# EAGLE schematic soundpuddle_megawing_mk2 (EAGLE 6.3)
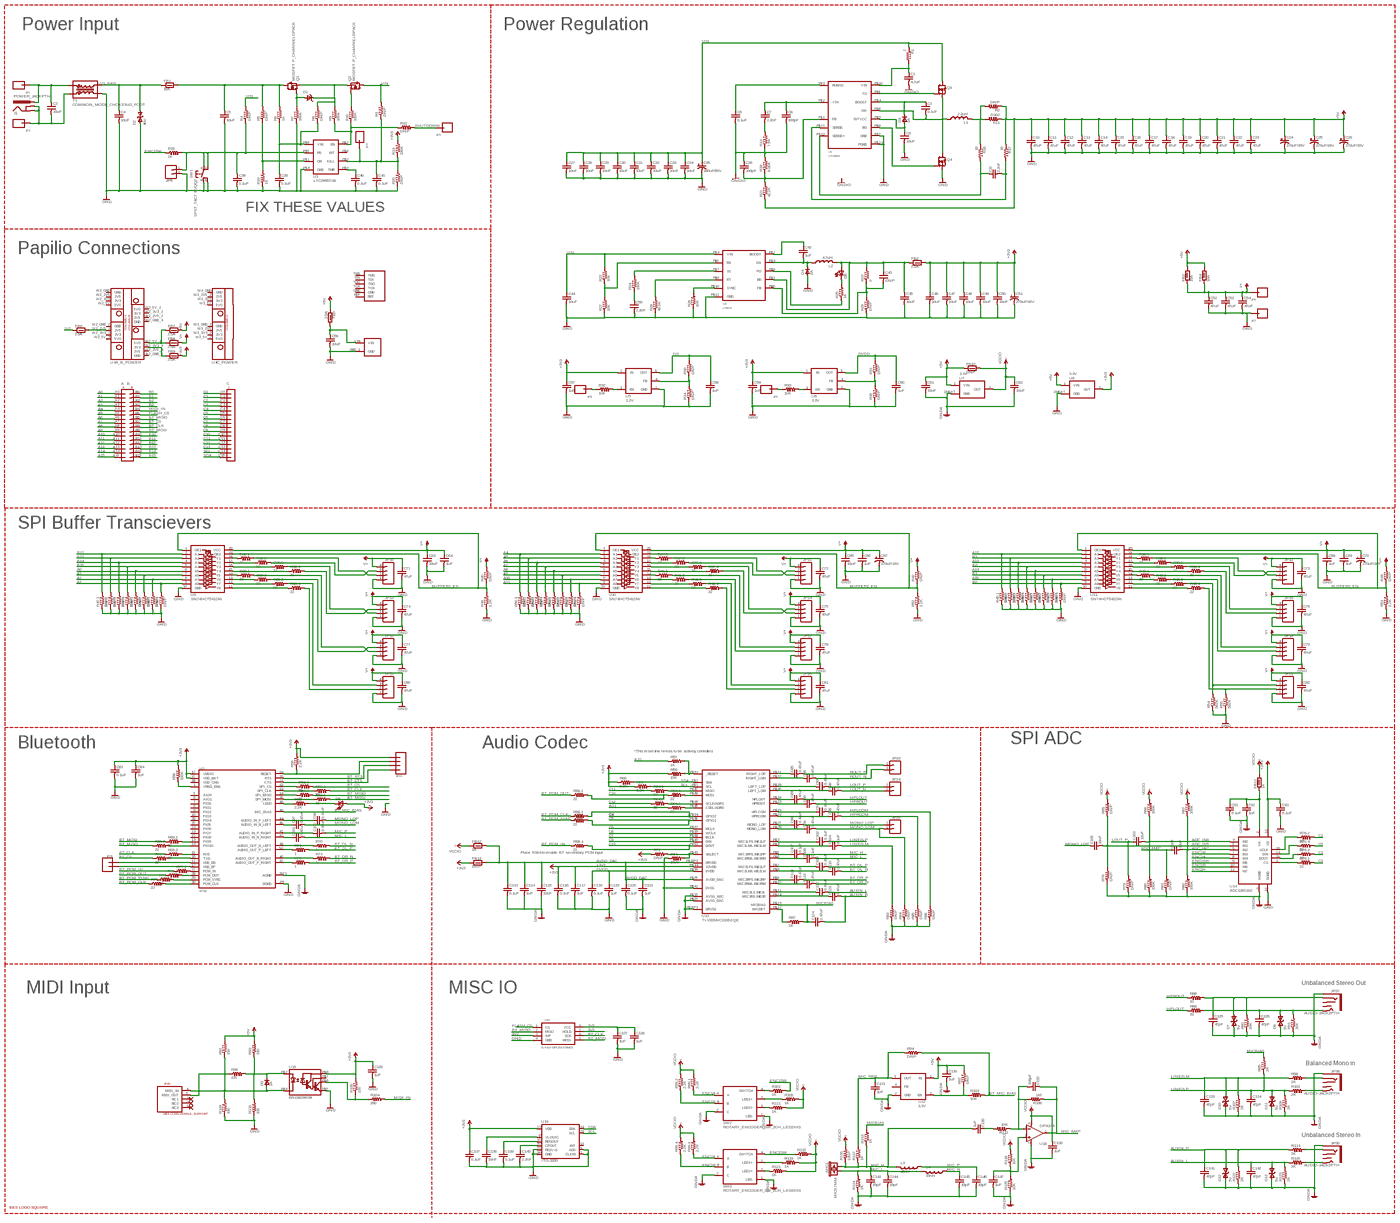
[diagram p0: schematic, sheet 1, overview]
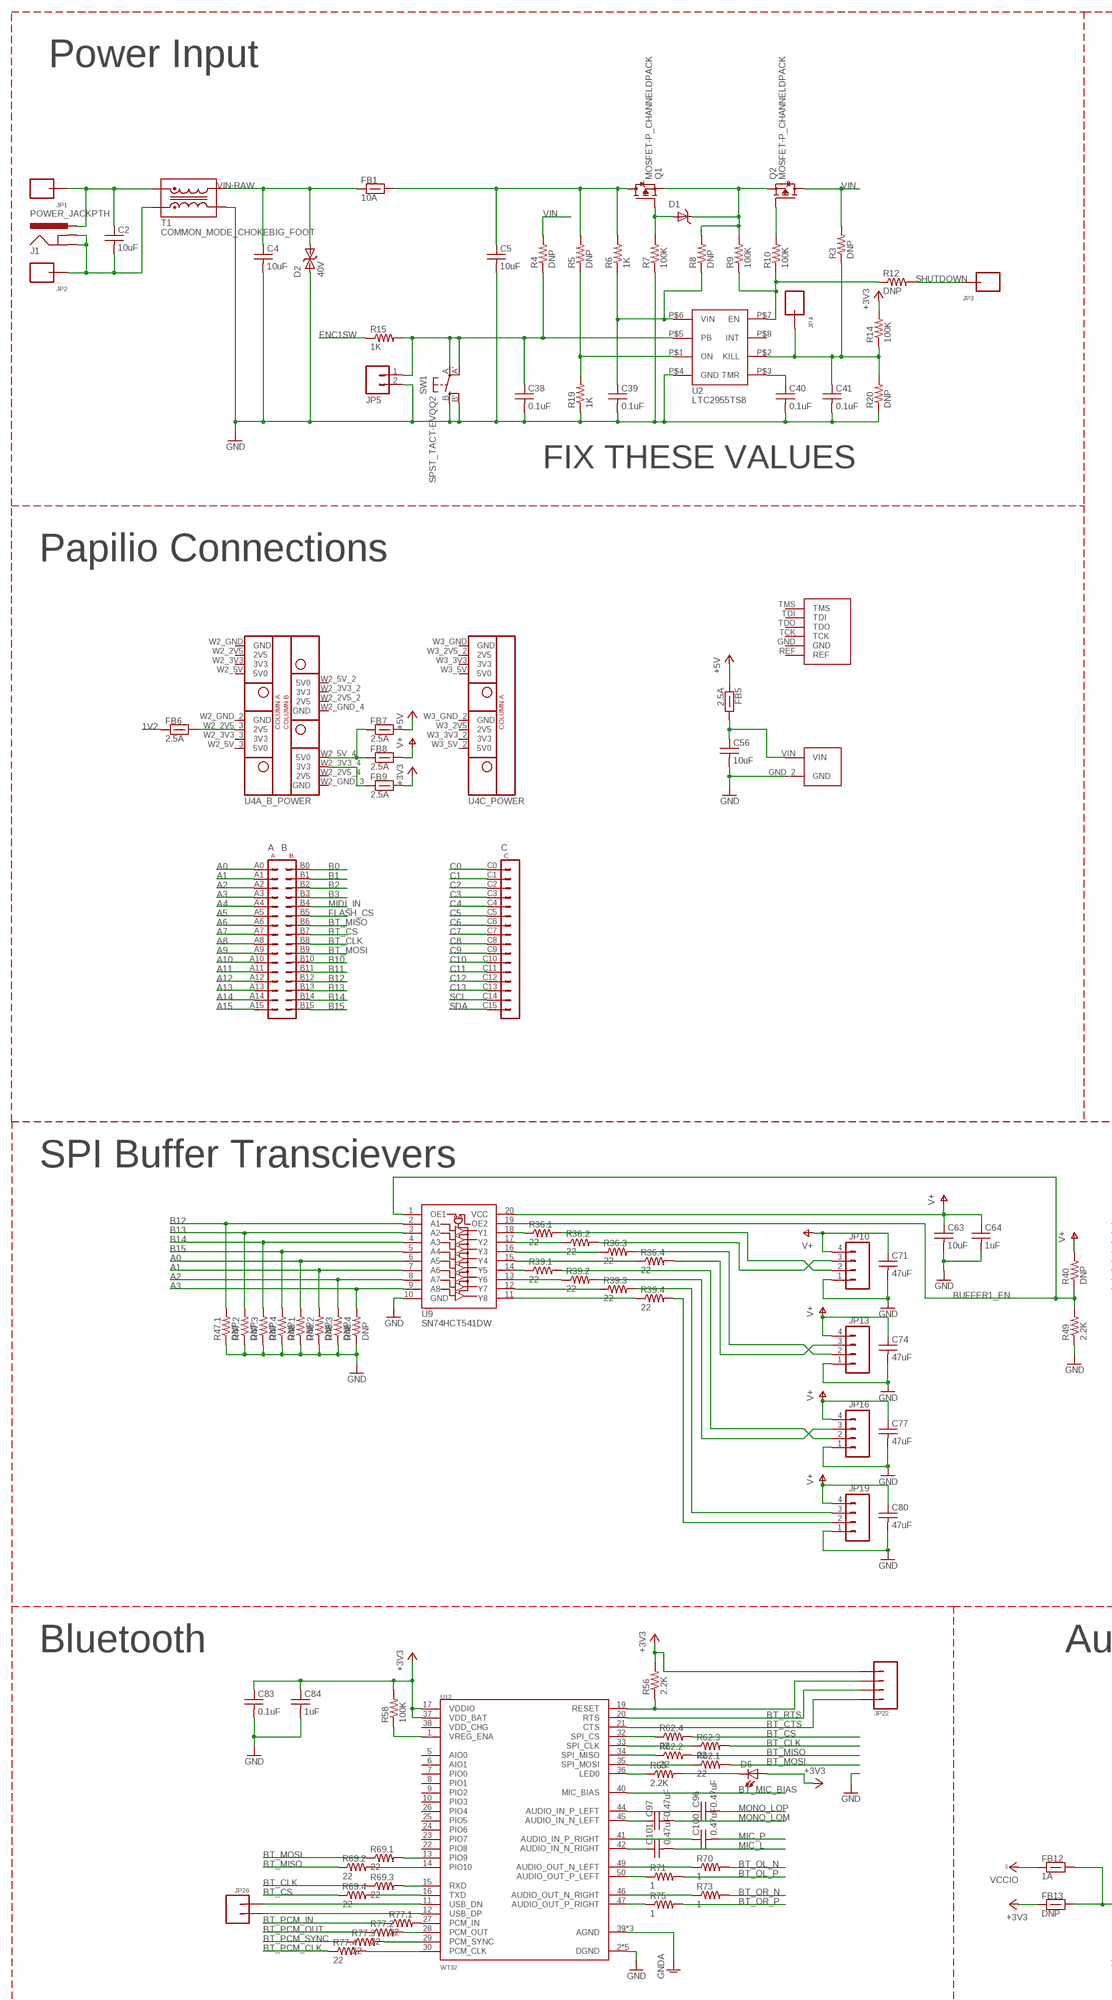
[diagram p1: schematic, sheet 1, part 1 of 4]
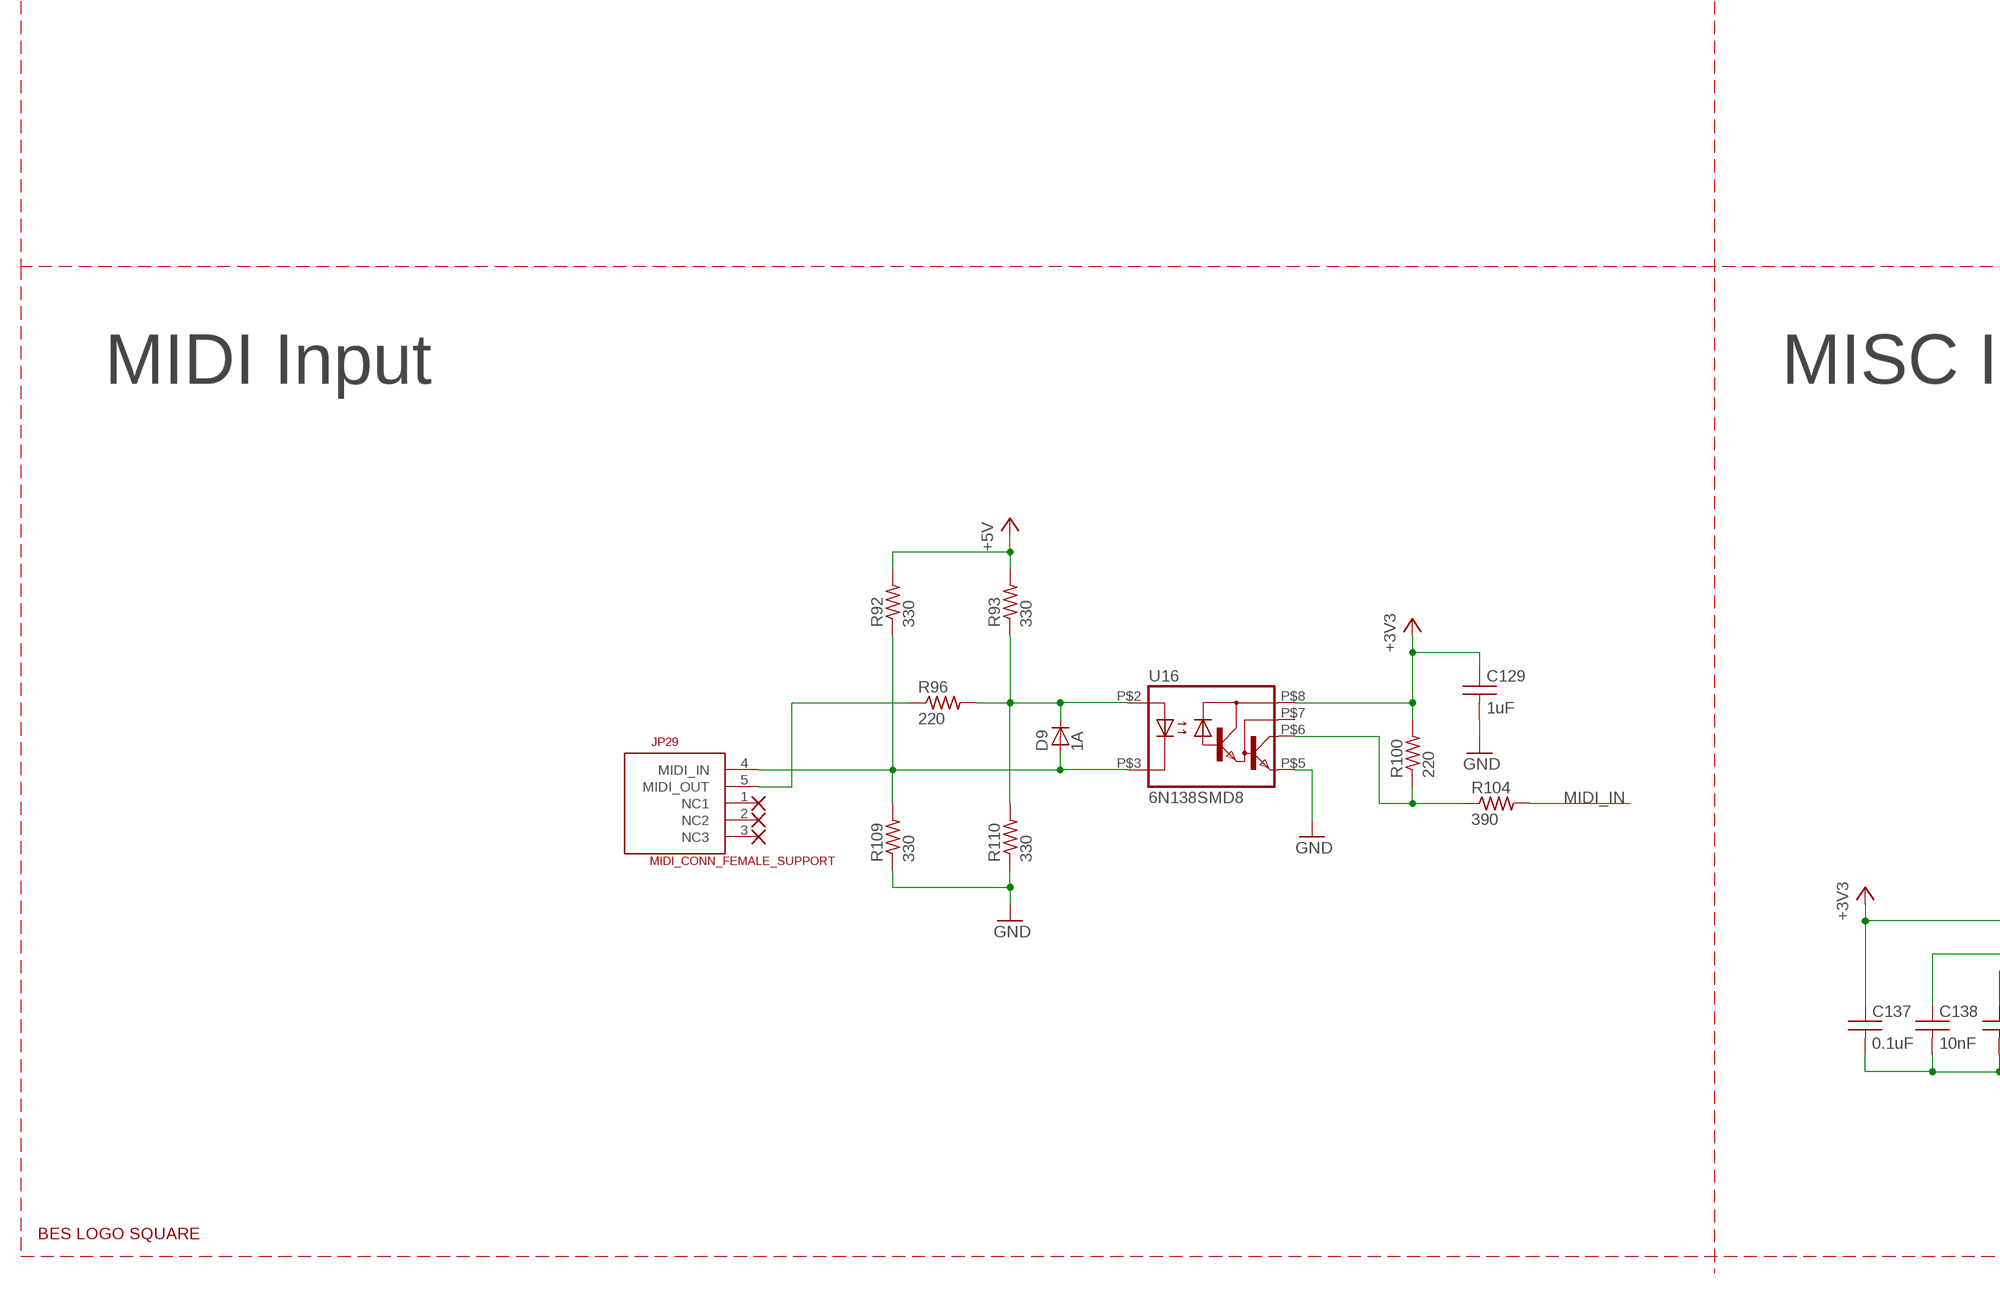
[diagram p2: schematic, sheet 1, part 2 of 4]
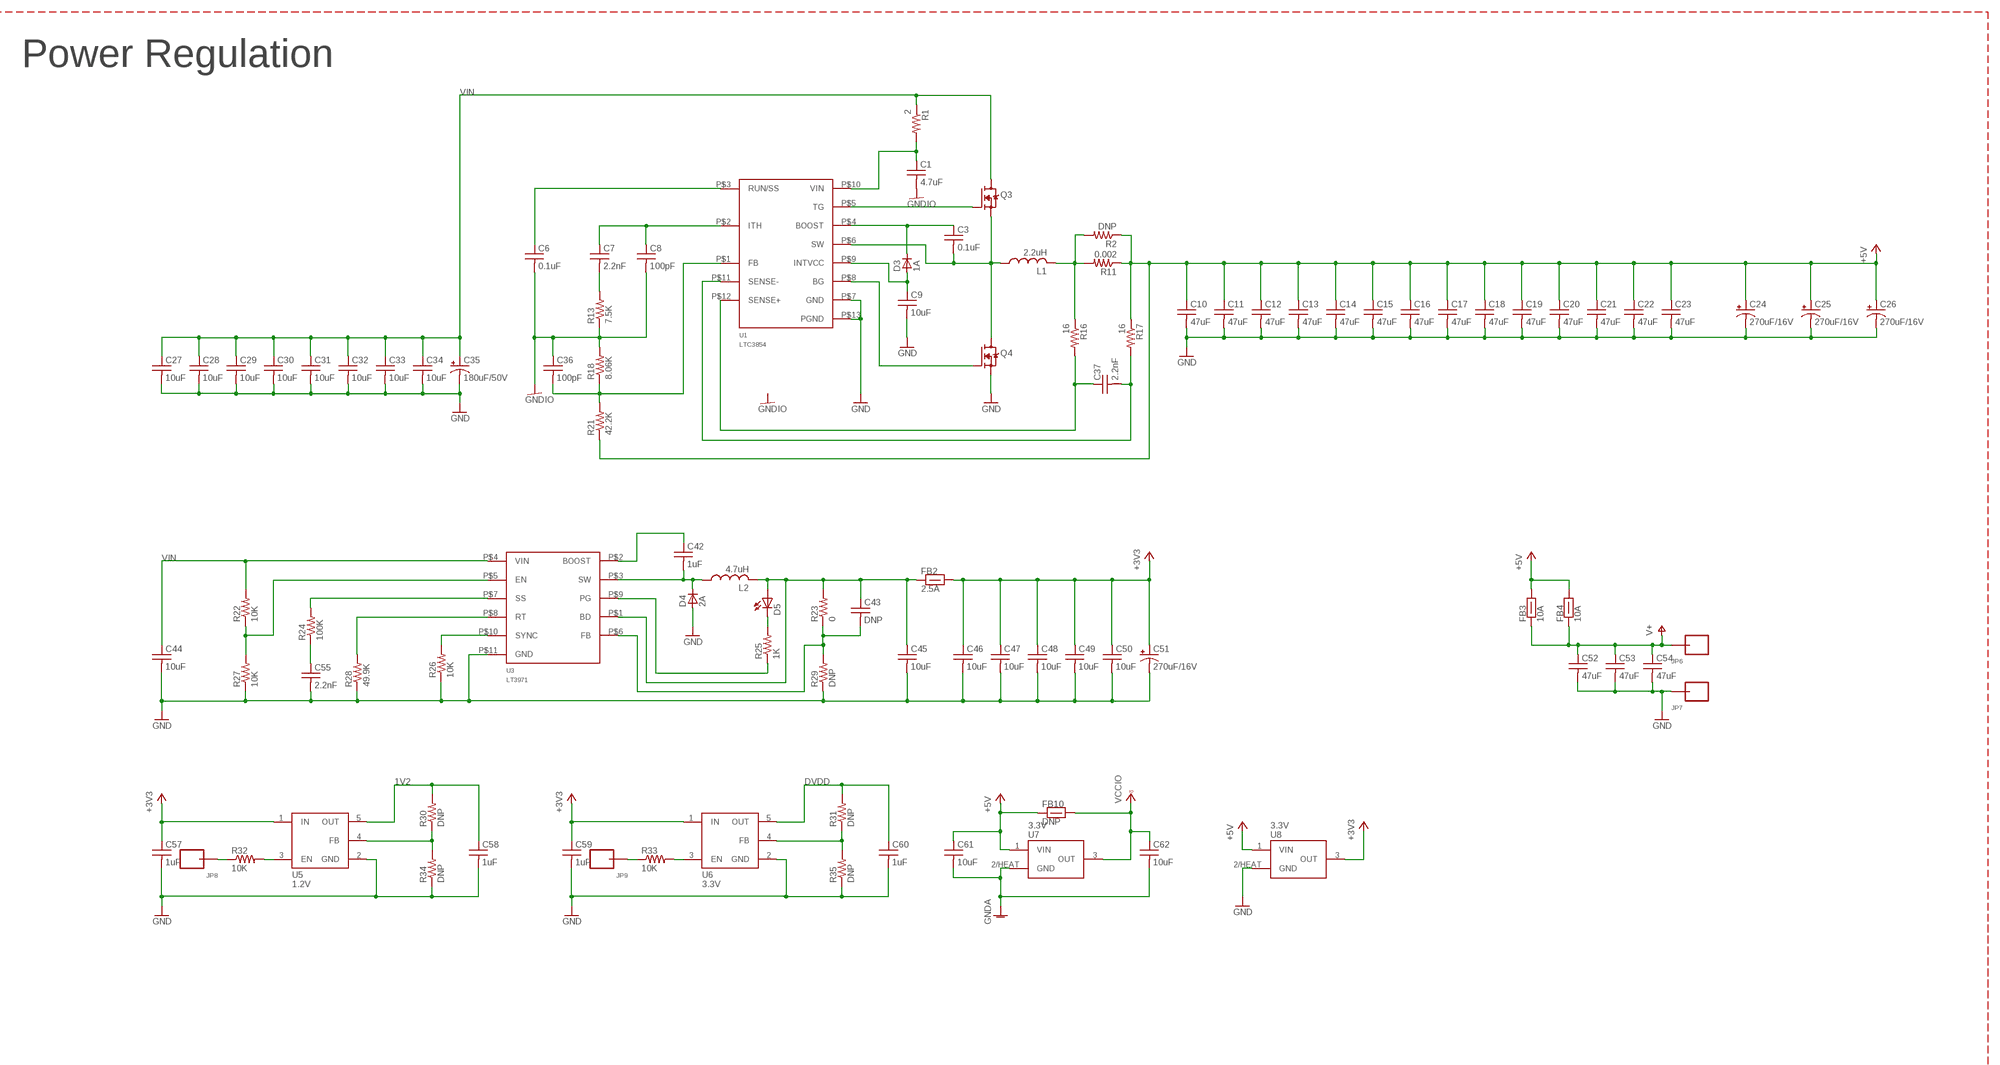
[diagram p3: schematic, sheet 1, part 3 of 4]
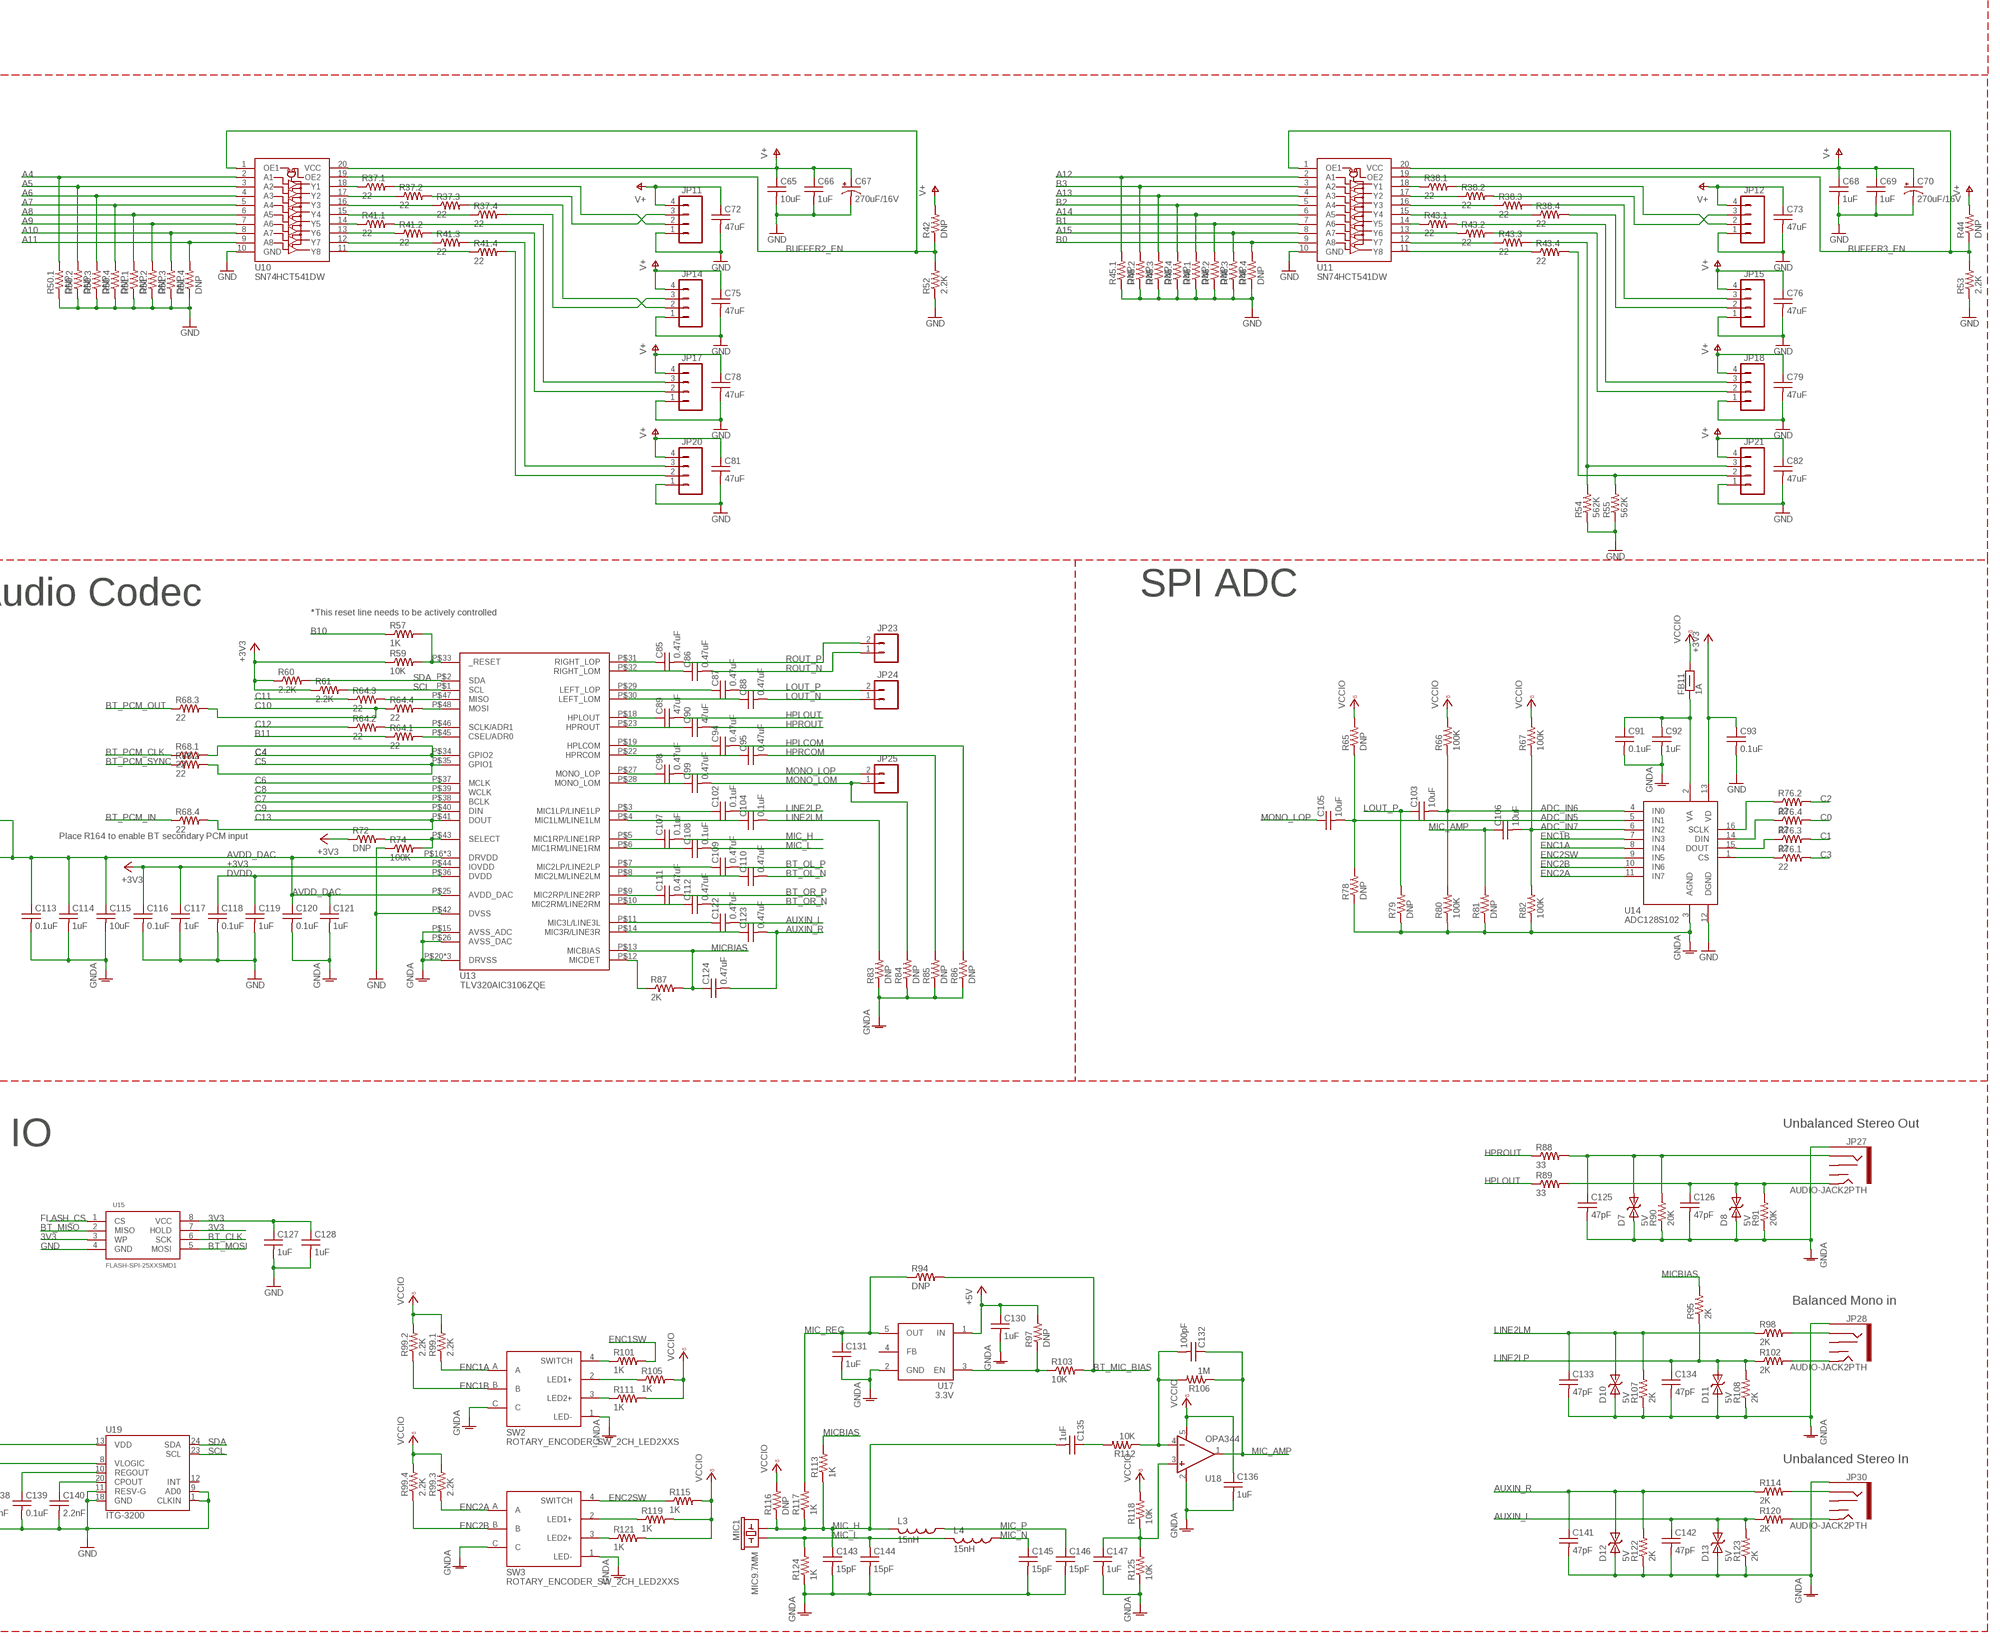
[diagram p4: schematic, sheet 1, part 4 of 4]

## Parts
C1  4.7uF  CAPACITORC_0603  [0603]
C2  10uF  CAPACITORC_1206  [1206]
C3  0.1uF  CAPACITORC_0805  [0805]
C4  10uF  CAPACITORC_1206  [1206]
C5  10uF  CAPACITORC_1206  [1206]
C6  0.1uF  CAPACITORC_0603  [0603]
C7  2.2nF  CAPACITORC_0603  [0603]
C8  100pF  CAPACITORC_0603  [0603]
C9  10uF  CAPACITORC_0805  [0805]
C10  47uF  CAPACITORC_1206  [1206]
C11  47uF  CAPACITORC_1206  [1206]
C12  47uF  CAPACITORC_1206  [1206]
C13  47uF  CAPACITORC_1206  [1206]
C14  47uF  CAPACITORC_1206  [1206]
C15  47uF  CAPACITORC_1206  [1206]
C16  47uF  CAPACITORC_1206  [1206]
C17  47uF  CAPACITORC_1206  [1206]
C18  47uF  CAPACITORC_1206  [1206]
C19  47uF  CAPACITORC_1206  [1206]
C20  47uF  CAPACITORC_1206  [1206]
C21  47uF  CAPACITORC_1206  [1206]
C22  47uF  CAPACITORC_1206  [1206]
C23  47uF  CAPACITORC_1206  [1206]
C24  270uF/16V  CAPACITOR_ELEC8MM_DIA  [CAP_RADIAL_THRUHOLE_8MM_DIA]
C25  270uF/16V  CAPACITOR_ELEC8MM_DIA  [CAP_RADIAL_THRUHOLE_8MM_DIA]
C26  270uF/16V  CAPACITOR_ELEC8MM_DIA  [CAP_RADIAL_THRUHOLE_8MM_DIA]
C27  10uF  CAPACITORC_1206  [1206]
C28  10uF  CAPACITORC_1206  [1206]
C29  10uF  CAPACITORC_1206  [1206]
C30  10uF  CAPACITORC_1206  [1206]
C31  10uF  CAPACITORC_1206  [1206]
C32  10uF  CAPACITORC_1206  [1206]
C33  10uF  CAPACITORC_1206  [1206]
C34  10uF  CAPACITORC_1206  [1206]
C35  180uF/50V  CAPACITOR_ELEC8MM_DIA  [CAP_RADIAL_THRUHOLE_8MM_DIA]
C36  100pF  CAPACITORC_0603  [0603]
C37  2.2nF  CAPACITORC_0603  [0603]
C38  0.1uF  CAPACITORC_0603  [0603]
C39  0.1uF  CAPACITORC_0603  [0603]
C40  0.1uF  CAPACITORC_0603  [0603]
C41  0.1uF  CAPACITORC_0603  [0603]
C42  1uF  CAPACITORC_0603  [0603]
C43  DNP  CAPACITORC_0603  [0603]
C44  10uF  CAPACITORC_1206  [1206]
C45  10uF  CAPACITORC_1206  [1206]
C46  10uF  CAPACITORC_1206  [1206]
C47  10uF  CAPACITORC_1206  [1206]
C48  10uF  CAPACITORC_1206  [1206]
C49  10uF  CAPACITORC_1206  [1206]
C50  10uF  CAPACITORC_1206  [1206]
C51  270uF/16V  CAPACITOR_ELEC8MM_DIA  [CAP_RADIAL_THRUHOLE_8MM_DIA]
C52  47uF  CAPACITORC_1206  [1206]
C53  47uF  CAPACITORC_1206  [1206]
C54  47uF  CAPACITORC_1206  [1206]
C55  2.2nF  CAPACITORC_0603  [0603]
C56  10uF  CAPACITORC_1206  [1206]
C57  1uF  CAPACITORC_0603  [0603]
C58  1uF  CAPACITORC_0603  [0603]
C59  1uF  CAPACITORC_0603  [0603]
C60  1uF  CAPACITORC_0603  [0603]
C61  10uF  CAPACITORC_1206  [1206]
C62  10uF  CAPACITORC_1206  [1206]
C63  10uF  CAPACITORC_0603  [0603]
C64  1uF  CAPACITORC_0603  [0603]
C65  10uF  CAPACITORC_0603  [0603]
C66  1uF  CAPACITORC_0603  [0603]
C67  270uF/16V  CAPACITOR_ELEC8MM_DIA  [CAP_RADIAL_THRUHOLE_8MM_DIA]
C68  1uF  CAPACITORC_0603  [0603]
C69  1uF  CAPACITORC_0603  [0603]
C70  270uF/16V  CAPACITOR_ELEC8MM_DIA  [CAP_RADIAL_THRUHOLE_8MM_DIA]
C71  47uF  CAPACITORC_1206  [1206]
C72  47uF  CAPACITORC_1206  [1206]
C73  47uF  CAPACITORC_1206  [1206]
C74  47uF  CAPACITORC_1206  [1206]
C75  47uF  CAPACITORC_1206  [1206]
C76  47uF  CAPACITORC_1206  [1206]
C77  47uF  CAPACITORC_1206  [1206]
C78  47uF  CAPACITORC_1206  [1206]
C79  47uF  CAPACITORC_1206  [1206]
C80  47uF  CAPACITORC_1206  [1206]
C81  47uF  CAPACITORC_1206  [1206]
C82  47uF  CAPACITORC_1206  [1206]
C83  0.1uF  CAPACITORC_0603  [0603]
C84  1uF  CAPACITORC_0603  [0603]
C85  0.47uF  CAPACITORC_0805  [0805]
C86  0.47uF  CAPACITORC_0805  [0805]
C87  0.47uF  CAPACITORC_0805  [0805]
C88  0.47uF  CAPACITORC_0805  [0805]
C89  47uF  CAPACITORC_1206  [1206]
C90  47uF  CAPACITORC_1206  [1206]
C91  0.1uF  CAPACITORC_0603  [0603]
C92  1uF  CAPACITORC_0603  [0603]
C93  0.1uF  CAPACITORC_0603  [0603]
C94  0.47uF  CAPACITORC_0805  [0805]
C95  0.47uF  CAPACITORC_0805  [0805]
C96  0.47uF  CAPACITORC_0805  [0805]
C97  0.47uF  CAPACITORC_0805  [0805]
C98  0.47uF  CAPACITORC_0805  [0805]
C99  0.47uF  CAPACITORC_0805  [0805]
C100  0.47uF  CAPACITORC_0805  [0805]
C101  0.47uF  CAPACITORC_0805  [0805]
C102  0.1uF  CAPACITORC_0805  [0805]
C103  10uF  CAPACITORC_0805  [0805]
C104  0.1uF  CAPACITORC_0805  [0805]
C105  10uF  CAPACITORC_0805  [0805]
C106  10uF  CAPACITORC_0805  [0805]
C107  0.1uF  CAPACITORC_0603  [0603]
C108  0.1uF  CAPACITORC_0603  [0603]
C109  0.47uF  CAPACITORC_0805  [0805]
C110  0.47uF  CAPACITORC_0805  [0805]
C111  0.47uF  CAPACITORC_0805  [0805]
C112  0.47uF  CAPACITORC_0805  [0805]
C113  0.1uF  CAPACITORC_0603  [0603]
C114  1uF  CAPACITORC_0603  [0603]
C115  10uF  CAPACITORC_0805  [0805]
C116  0.1uF  CAPACITORC_0603  [0603]
C117  1uF  CAPACITORC_0603  [0603]
C118  0.1uF  CAPACITORC_0603  [0603]
C119  1uF  CAPACITORC_0603  [0603]
C120  0.1uF  CAPACITORC_0603  [0603]
C121  1uF  CAPACITORC_0603  [0603]
C122  0.47uF  CAPACITORC_0805  [0805]
C123  0.47uF  CAPACITORC_0805  [0805]
C124  0.47uF  CAPACITORC_0805  [0805]
C125  47pF  CAPACITORC_0603  [0603]
C126  47pF  CAPACITORC_0603  [0603]
C127  1uF  CAPACITORC_0603  [0603]
C128  1uF  CAPACITORC_0603  [0603]
C129  1uF  CAPACITORC_0603  [0603]
C130  1uF  CAPACITORC_0603  [0603]
C131  1uF  CAPACITORC_0603  [0603]
C132  100pF  CAPACITORC_0603  [0603]
C133  47pF  CAPACITORC_0603  [0603]
C134  47pF  CAPACITORC_0603  [0603]
C135  1uF  CAPACITORC_0603  [0603]
C136  1uF  CAPACITORC_0603  [0603]
C137  0.1uF  CAPACITORC_0603  [0603]
C138  10nF  CAPACITORC_0603  [0603]
C139  0.1uF  CAPACITORC_0603  [0603]
C140  2.2nF  CAPACITORC_0603  [0603]
C141  47pF  CAPACITORC_0603  [0603]
C142  47pF  CAPACITORC_0603  [0603]
C143  15pF  CAPACITORC_0603  [0603]
C144  15pF  CAPACITORC_0603  [0603]
C145  15pF  CAPACITORC_0603  [0603]
C146  15pF  CAPACITORC_0603  [0603]
C147  1uF  CAPACITORC_0603  [0603]
D1  ZENER_SOD-323  [SOD-323]
D2  40V  SURGESUPPRESSORSMBJ  [SMB]
D3  1A  DIODE_SMDSOD-123F  [SOD-123F]
D4  2A  DIODE_SMDDO-214AC  [DIODE_DO-214AC]
D5  LED0805  [LED_0805]
D6  LED0805  [LED_0805]
D7  5V  SURGESUPPRESSOR603  [0603]
D8  5V  SURGESUPPRESSOR603  [0603]
D9  1A  DIODE_SMDSOD-123F  [SOD-123F]
D10  5V  SURGESUPPRESSOR603  [0603]
D11  5V  SURGESUPPRESSOR603  [0603]
D12  5V  SURGESUPPRESSOR603  [0603]
D13  5V  SURGESUPPRESSOR603  [0603]
FB1  10A  FERRITE-BEAD1612  [1612]
FB2  2.5A  FERRITE-BEAD0805  [0805]
FB3  10A  FERRITE-BEAD1612  [1612]
FB4  10A  FERRITE-BEAD1612  [1612]
FB5  2.5A  FERRITE-BEAD0805  [0805]
FB6  2.5A  FERRITE-BEAD0805  [0805]
FB7  2.5A  FERRITE-BEAD0805  [0805]
FB8  2.5A  FERRITE-BEAD0805  [0805]
FB9  2.5A  FERRITE-BEAD0805  [0805]
FB10  DNP  FERRITE-BEAD0603  [0603]
FB11  1A  FERRITE-BEAD0603  [0603]
FB12  1A  FERRITE-BEAD0603  [0603]
FB13  DNP  FERRITE-BEAD0603  [0603]
J1  POWER_JACKPTH  [POWER_JACK_PTH]
JP1  ANDERSON_POWERPOLEVERTICAL  [ANDERSON_25A_VERTICAL_1P]
JP2  ANDERSON_POWERPOLEVERTICAL  [ANDERSON_25A_VERTICAL_1P]
JP3  HEADER-SMALL-1PIN  [HEADER-SMALL-1PIN-0.036IN]
JP4  HEADER-SMALL-1PIN  [HEADER-SMALL-1PIN-0.036IN]
JP5  M02PTH  [1X02]
JP6  ANDERSON_POWERPOLEVERTICAL  [ANDERSON_25A_VERTICAL_1P]
JP7  ANDERSON_POWERPOLEVERTICAL  [ANDERSON_25A_VERTICAL_1P]
JP8  HEADER-SMALL-1PIN  [HEADER-SMALL-1PIN-0.036IN]
JP9  HEADER-SMALL-1PIN  [HEADER-SMALL-1PIN-0.036IN]
JP10  M04POLAR  [MOLEX-1X4]
JP11  M04POLAR  [MOLEX-1X4]
JP12  M04POLAR  [MOLEX-1X4]
JP13  M04POLAR  [MOLEX-1X4]
JP14  M04POLAR  [MOLEX-1X4]
JP15  M04POLAR  [MOLEX-1X4]
JP16  M04POLAR  [MOLEX-1X4]
JP17  M04POLAR  [MOLEX-1X4]
JP18  M04POLAR  [MOLEX-1X4]
JP19  M04POLAR  [MOLEX-1X4]
JP20  M04POLAR  [MOLEX-1X4]
JP21  M04POLAR  [MOLEX-1X4]
JP22  HEADER-SMALL-4PIN0.1IN  [HEADER-SMALL-4PIN-0.036IN]
JP23  M02POLAR  [MOLEX-1X2]
JP24  M02POLAR  [MOLEX-1X2]
JP25  M02POLAR  [MOLEX-1X2]
JP26  HEADER-SMALL-2PIN0.1IN  [HEADER-SMALL-2PIN-0.036IN]
JP27  AUDIO-JACK2PTH  [AUDIO-JACK]
JP28  AUDIO-JACK2PTH  [AUDIO-JACK]
JP29  MIDI_CONN_FEMALE_SUPPORT  [DIN_5_FEMALE_SUPPORT]
JP30  AUDIO-JACK2PTH  [AUDIO-JACK]
L1  2.2uH  INDUCTORHC1  [INDUCTOR_HC1]
L2  4.7uH  INDUCTOR6X6MM  [INDUCTOR_6X6MM]
L3  15nH  INDUCTOR0805  [0805]
L4  15nH  INDUCTOR0805  [0805]
LOGO  LOGO  [LOGO]
MIC1  MIC9.7MM  [MIC-9.7MM]
Q1  MOSFET-P_CHANNELDPACK  [DPACK_1]
Q2  MOSFET-P_CHANNELDPACK  [DPACK_1]
Q3  MOSFET_N_CHANNELLFPAK  [POWERPAK_SO-8_LFPAK]
Q4  MOSFET_N_CHANNELLFPAK  [POWERPAK_SO-8_LFPAK]
R1  2  RESISTORR_0603  [0603]
R2  DNP  RESISTOR2512  [2512]
R3  DNP  RESISTORR_0603  [0603]
R4  DNP  RESISTORR_0603  [0603]
R5  DNP  RESISTORR_0603  [0603]
R6  1K  RESISTORR_0603  [0603]
R7  100K  RESISTORR_0603  [0603]
R8  DNP  RESISTORR_0603  [0603]
R9  100K  RESISTORR_0603  [0603]
R10  100K  RESISTORR_0603  [0603]
R11  0.002  RESISTOR2512  [2512]
R12  DNP  RESISTORR_0603  [0603]
R13  7.5K  RESISTORR_0603  [0603]
R14  100K  RESISTORR_0603  [0603]
R15  1K  RESISTORR_0603  [0603]
R16  16  RESISTORR_0805  [0805]
R17  16  RESISTORR_0805  [0805]
R18  8.06K  RESISTORR_0603  [0603]
R19  1K  RESISTORR_0603  [0603]
R20  DNP  RESISTORR_0603  [0603]
R21  42.2K  RESISTORR_0603  [0603]
R22  10K  RESISTORR_0603  [0603]
R23  0  RESISTORR_0603  [0603]
R24  100K  RESISTORR_0603  [0603]
R25  1K  RESISTORR_0603  [0603]
R26  10K  RESISTORR_0603  [0603]
R27  10K  RESISTORR_0603  [0603]
R28  49.9K  RESISTORR_0603  [0603]
R29  DNP  RESISTORR_0603  [0603]
R30  DNP  RESISTORR_0603  [0603]
R31  DNP  RESISTORR_0603  [0603]
R32  10K  RESISTORR_0603  [0603]
R33  10K  RESISTORR_0603  [0603]
R34  DNP  RESISTORR_0603  [0603]
R35  DNP  RESISTORR_0603  [0603]
R36  22  RESISTOR_ARRAY_4CHCRA06S  [RESISTOR_ARRAY_1206_4CH_CRA06S]
R37  22  RESISTOR_ARRAY_4CHCRA06S  [RESISTOR_ARRAY_1206_4CH_CRA06S]
R38  22  RESISTOR_ARRAY_4CHCRA06S  [RESISTOR_ARRAY_1206_4CH_CRA06S]
R39  22  RESISTOR_ARRAY_4CHCRA06S  [RESISTOR_ARRAY_1206_4CH_CRA06S]
R40  DNP  RESISTORR_0603  [0603]
R41  22  RESISTOR_ARRAY_4CHCRA06S  [RESISTOR_ARRAY_1206_4CH_CRA06S]
R42  DNP  RESISTORR_0603  [0603]
R43  22  RESISTOR_ARRAY_4CHCRA06S  [RESISTOR_ARRAY_1206_4CH_CRA06S]
R44  DNP  RESISTORR_0603  [0603]
R45  DNP  RESISTOR_ARRAY_4CHCRA06S  [RESISTOR_ARRAY_1206_4CH_CRA06S]
R46  DNP  RESISTOR_ARRAY_4CHCRA06S  [RESISTOR_ARRAY_1206_4CH_CRA06S]
R47  DNP  RESISTOR_ARRAY_4CHCRA06S  [RESISTOR_ARRAY_1206_4CH_CRA06S]
R48  DNP  RESISTOR_ARRAY_4CHCRA06S  [RESISTOR_ARRAY_1206_4CH_CRA06S]
R49  2.2K  RESISTORR_0603  [0603]
R50  DNP  RESISTOR_ARRAY_4CHCRA06S  [RESISTOR_ARRAY_1206_4CH_CRA06S]
R51  DNP  RESISTOR_ARRAY_4CHCRA06S  [RESISTOR_ARRAY_1206_4CH_CRA06S]
R52  2.2K  RESISTORR_0603  [0603]
R53  2.2K  RESISTORR_0603  [0603]
R54  562K  RESISTORR_0603  [0603]
R55  562K  RESISTORR_0603  [0603]
R56  2.2K  RESISTORR_0603  [0603]
R57  1K  RESISTORR_0603  [0603]
R58  100K  RESISTORR_0603  [0603]
R59  10K  RESISTORR_0603  [0603]
R60  2.2K  RESISTORR_0603  [0603]
R61  2.2K  RESISTORR_0603  [0603]
R62  22  RESISTOR_ARRAY_4CHCRA06S  [RESISTOR_ARRAY_1206_4CH_CRA06S]
R63  2.2K  RESISTORR_0603  [0603]
R64  22  RESISTOR_ARRAY_4CHCRA06S  [RESISTOR_ARRAY_1206_4CH_CRA06S]
R65  DNP  RESISTORR_0603  [0603]
R66  100K  RESISTORR_0603  [0603]
R67  100K  RESISTORR_0603  [0603]
R68  22  RESISTOR_ARRAY_4CHCRA06S  [RESISTOR_ARRAY_1206_4CH_CRA06S]
R69  22  RESISTOR_ARRAY_4CHCRA06S  [RESISTOR_ARRAY_1206_4CH_CRA06S]
R70  1  RESISTORR_0805  [0805]
R71  1  RESISTORR_0805  [0805]
R72  DNP  RESISTORR_0603  [0603]
R73  1  RESISTORR_0805  [0805]
R74  100K  RESISTORR_0603  [0603]
R75  1  RESISTORR_0805  [0805]
R76  22  RESISTOR_ARRAY_4CHCRA06S  [RESISTOR_ARRAY_1206_4CH_CRA06S]
R77  22  RESISTOR_ARRAY_4CHCRA06S  [RESISTOR_ARRAY_1206_4CH_CRA06S]
R78  DNP  RESISTORR_0603  [0603]
R79  DNP  RESISTORR_0603  [0603]
R80  100K  RESISTORR_0603  [0603]
R81  DNP  RESISTORR_0603  [0603]
R82  100K  RESISTORR_0603  [0603]
R83  DNP  RESISTORR_0603  [0603]
R84  DNP  RESISTORR_0603  [0603]
R85  DNP  RESISTORR_0603  [0603]
R86  DNP  RESISTORR_0603  [0603]
R87  2K  RESISTORR_0603  [0603]
R88  33  RESISTORR_0805  [0805]
R89  33  RESISTORR_0805  [0805]
R90  20K  RESISTORR_0603  [0603]
R91  20K  RESISTORR_0603  [0603]
R92  330  RESISTORR_0603  [0603]
R93  330  RESISTORR_0603  [0603]
R94  DNP  RESISTORR_0603  [0603]
R95  2K  RESISTORR_0603  [0603]
R96  220  RESISTORR_0603  [0603]
R97  DNP  RESISTORR_0603  [0603]
R98  2K  RESISTORR_0805  [0805]
R99  2.2K  RESISTOR_ARRAY_4CHCRA06S  [RESISTOR_ARRAY_1206_4CH_CRA06S]
R100  220  RESISTORR_0603  [0603]
R101  1K  RESISTORR_0603  [0603]
R102  2K  RESISTORR_0805  [0805]
R103  10K  RESISTORR_0603  [0603]
R104  390  RESISTORR_0603  [0603]
R105  1K  RESISTORR_0603  [0603]
R106  1M  RESISTORR_0603  [0603]
R107  2K  RESISTORR_0603  [0603]
R108  2K  RESISTORR_0603  [0603]
R109  330  RESISTORR_0603  [0603]
R110  330  RESISTORR_0603  [0603]
R111  1K  RESISTORR_0603  [0603]
R112  10K  RESISTORR_0603  [0603]
R113  1K  RESISTORR_0603  [0603]
R114  2K  RESISTORR_0805  [0805]
R115  1K  RESISTORR_0603  [0603]
R116  DNP  RESISTORR_0603  [0603]
R117  1K  RESISTORR_0603  [0603]
R118  10K  RESISTORR_0603  [0603]
R119  1K  RESISTORR_0603  [0603]
R120  2K  RESISTORR_0805  [0805]
R121  1K  RESISTORR_0603  [0603]
R122  2K  RESISTORR_0603  [0603]
R123  2K  RESISTORR_0603  [0603]
R124  1K  RESISTORR_0603  [0603]
R125  10K  RESISTORR_0603  [0603]
SW1  SPST_TACT-EVQQ2  [EVQ-Q2]
SW2  ROTARY_ENCODER_SW_2CH_LED2XXS  [ROTARY_ENCODER_BOURNS_PEL12D]
SW3  ROTARY_ENCODER_SW_2CH_LED2XXS  [ROTARY_ENCODER_BOURNS_PEL12D]
T1  COMMON_MODE_CHOKEBIG_FOOT  [CM-CHOKE_PULSE_BIG-FOOT]
U1  LTC3854  [MSOP12+1]
U2  LTC2955TS8  [TSOT-23-8]
U3  LT3971  [MSOP10+1_LT]
U4  PAPILIO_PLUS_MEGAWING  [PAPILIO_PLUS]
U5  1.2V  LDO_EN_FB  [TSOT23]
U6  3.3V  LDO_EN_FB  [TSOT23]
U7  3.3V  LDODPAK_ALT  [DPACK_1]
U8  3.3V  LDODPAK_ALT  [DPACK_1]
U9  SN74HCT541DW  [SOIC-20_TI_DW]
U10  SN74HCT541DW  [SOIC-20_TI_DW]
U11  SN74HCT541DW  [SOIC-20_TI_DW]
U12  WT32  [WT32_BT_MODULE]
U13  TLV320AIC3106ZQE  [QFN48+1]
U14  ADC128S102  [TSSOP16]
U15  FLASH-SPI-25XXSMD1  [SO08-EIAJ]
U16  6N138SMD8  [SMD-8]
U17  3.3V  LDO_EN_FB  [TSOT23]
U18  OPA344  [SOT23-5]
U19  ITG-3200  [QFN-24]

## Nets
1V2: C58.1 FB6.1 R30.2 U5.5(OUT)
3V3: C127.1 C128.1 U15.3(WP) U15.7(HOLD) U15.8(VCC)
+3V3: C46.P$1 C47.P$1 C48.P$1 C49.P$1 C50.P$1 C51.P$2(+) C57.1 C59.1 C83.1 C84.1 C93.1 C116.1 C117.1 C129.1 C137.1 D6.1(A) FB2.2 FB9.2 FB13.1 JP22.P$4 R14.2 R56.2 R58.2 R59.1 R60.1 R61.1 R72.1 R100.2 U5.1(IN) U6.1(IN) U8.3(OUT) U12.17(VDDIO) U12.37(VDD_BAT) U13.P$44(IOVDD) U14.13(VD) U16.P$8(VCC) U19.13(VDD)
+5V: C10.P$1 C11.P$1 C12.P$1 C13.P$1 C14.P$1 C15.P$1 C16.P$1 C17.P$1 C18.P$1 C19.P$1 C20.P$1 C21.P$1 C22.P$1 C23.P$1 C24.P$2(+) C25.P$2(+) C26.P$2(+) C61.P$1 C130.1 FB3.2 FB4.2 FB5.1 FB7.2 FB10.1 R2.1 R11.1 R17.1 R21.1 R92.2 R93.2 R97.2 U7.1(VIN) U8.1(VIN) U17.1(IN)
A0: R48.P$8 U4.A0 U9.6(A5)
A1: R48.P$7 U4.A1 U9.7(A6)
A2: R48.P$6 U4.A2 U9.8(A7)
A3: R48.P$5 U4.A3 U9.9(A8)
A4: R50.P$8 U4.A4 U10.2(A1)
A5: R50.P$7 U4.A5 U10.3(A2)
A6: R50.P$6 U4.A6 U10.4(A3)
A7: R50.P$5 U4.A7 U10.5(A4)
A8: R51.P$8 U4.A8 U10.6(A5)
A9: R51.P$7 U4.A9 U10.7(A6)
A10: R51.P$6 U4.A10 U10.8(A7)
A11: R51.P$5 U4.A11 U10.9(A8)
A12: R45.P$8 U4.A12 U11.2(A1)
A13: R45.P$6 U4.A13 U11.4(A3)
A14: R46.P$8 U4.A14 U11.6(A5)
A15: R46.P$6 U4.A15 U11.8(A7)
ADC_IN5: C105.2 R65.1 R78.2 U14.5(IN1)
ADC_IN6: C103.2 R66.1 R80.2 U14.4(IN0)
ADC_IN7: C106.2 R67.1 R82.2 U14.6(IN2)
AUXIN_L: C122.2 C142.1 D13.1(A) R120.1 R123.2
AUXIN_R: C123.2 C124.2 C141.1 D12.1(A) R114.1 R122.2
AVDD_DAC: C113.1 C114.1 C115.1 C120.1 C121.1 FB12.2 FB13.2 U13.P$16(DRVDD) U13.P$17(DRVDD) U13.P$24(DRVDD) U13.P$25(AVDD_DAC)
B0: R46.P$5 U4.B0 U11.9(A8)
B1: R46.P$7 U4.B1 U11.7(A6)
B2: R45.P$5 U4.B2 U11.5(A4)
B3: R45.P$7 U4.B3 U11.3(A2)
B10: R57.1 U4.B10
B11: R64.P$1 U4.B11
B12: R47.P$8 U4.B12 U9.2(A1)
B13: R47.P$7 U4.B13 U9.3(A2)
B14: R47.P$6 U4.B14 U9.4(A3)
B15: R47.P$5 U4.B15 U9.5(A4)
BT_CLK: R62.P$6 R69.P$3 U4.B8 U15.6(SCK)
BT_CS: R62.P$5 R69.P$4 U4.B7
BT_CTS: JP22.P$1 U12.21(CTS)
BT_MIC_BIAS: R94.2 R103.2 U12.40(MIC_BIAS)
BT_MISO: R62.P$7 R69.P$2 U4.B6 U15.2(MISO)
BT_MOSI: R62.P$8 R69.P$1 U4.B9 U15.5(MOSI)
BT_OL_N: C110.2 R70.2
BT_OL_P: C109.2 R71.2
BT_OR_N: C112.2 R73.2
BT_OR_P: C111.2 R75.2
BT_PCM_CLK: R68.P$1 R77.P$4
BT_PCM_IN: R68.P$4 R77.P$1
BT_PCM_OUT: R68.P$3 R77.P$2
BT_PCM_SYNC: R68.P$2 R77.P$3
BT_RTS: JP22.P$2 U12.20(RTS)
BUFFER1_EN: R40.1 R49.2 U9.1(OE1) U9.19(OE2)
BUFFER2_EN: R42.1 R52.2 U10.1(OE1) U10.19(OE2)
BUFFER3_EN: R44.1 R53.2 U11.1(OE1) U11.19(OE2)
C0: R76.P$5 U4.C0
C1: R76.P$6 U4.C1
C2: R76.P$7 U4.C2
C3: R76.P$8 U4.C3
C4: R68.P$8 U4.C4 U13.P$34(GPIO2)
C5: R68.P$7 U4.C5 U13.P$35(GPIO1)
C6: U4.C6 U13.P$37(MCLK)
C7: U4.C7 U13.P$38(BCLK)
C8: U4.C8 U13.P$39(WCLK)
C9: U4.C9 U13.P$40(DIN)
C10: R64.P$4 R68.P$6 U4.C10
C11: R64.P$3 U4.C11
C12: R64.P$2 U4.C12
C13: R68.P$5 U4.C13 U13.P$41(DOUT)
CH1_CLK: JP10.3 R36.P$7
CH1_DATA: JP10.2 R36.P$8
CH2_CLK: JP13.3 R36.P$5
CH2_DATA: JP13.2 R36.P$6
CH3_CLK: JP16.3 R39.P$7
CH3_DATA: JP16.2 R39.P$8
CH4_CLK: JP19.3 R39.P$6
CH4_DATA: JP19.2 R39.P$5
CH5_CLK: JP11.3 R37.P$7
CH5_DATA: JP11.2 JP14.2 R37.P$6 R37.P$8
CH6_CLK: JP14.3 R37.P$5
CH7_CLK: JP17.3 R41.P$8
CH7_DATA: JP17.2 R41.P$7
CH8_CLK: JP20.3 R41.P$6
CH8_DATA: JP20.2 R41.P$5
CH9_CLK: JP12.3 R38.P$7
CH9_DATA: JP12.2 R38.P$8
CH10_CLK: JP15.3 R38.P$6
CH10_DATA: JP15.2 R38.P$5
CH11_CLK: JP18.3 R43.P$8
CH11_DATA: JP18.2 R43.P$7
CH12_CLK: JP21.3 R43.P$6 R54.2
CH12_DATA: JP21.2 R43.P$5 R55.2
DVDD: C60.1 C118.1 C119.1 R31.2 U6.5(OUT) U13.P$36(DVDD)
ENC1A: R99.P$1 SW2.A U14.8(IN4)
ENC1B: R99.P$2 SW2.B U14.7(IN3)
ENC1SW: R15.1 R101.2
ENC2A: R99.P$3 SW3.A U14.11(IN7)
ENC2B: R99.P$4 SW3.B U14.10(IN6)
ENC2SW: R115.1 SW3.4(SWITCH) U14.9(IN5)
FLASH_CS: U4.B5 U15.1(CS)
GND: C4.P$2 C5.P$2 C9.2 C10.P$2 C11.P$2 C12.P$2 C13.P$2 C14.P$2 C15.P$2 C16.P$2 C17.P$2 C18.P$2 C19.P$2 C20.P$2 C21.P$2 C22.P$2 C23.P$2 C24.P$1(-) C25.P$1(-) C26.P$1(-) C27.P$2 C28.P$2 C29.P$2 C30.P$2 C31.P$2 C32.P$2 C33.P$2 C34.P$2 C35.P$1(-) C38.2 C39.2 C40.2 C41.2 C44.P$2 C45.P$2 C46.P$2 C47.P$2 C48.P$2 C49.P$2 C50.P$2 C51.P$1(-) C52.P$2 C53.P$2 C54.P$2 C55.2 C56.P$2 C57.2 C58.2 C59.2 C60.2 C63.2 C64.2 C65.2 C66.2 C67.P$1(-) C68.2 C69.2 C70.P$1(-) C71.P$2 C72.P$2 C73.P$2 C74.P$2 C75.P$2 C76.P$2 C77.P$2 C78.P$2 C79.P$2 C80.P$2 C81.P$2 C82.P$2 C83.2 C84.2 C93.2 C116.2 C117.2 C118.2 C119.2 C127.2 C128.2 C129.2 C137.2 C138.2 C139.2 C140.2 D2.P$2(C) D4.P$2(A) JP5.2 JP7.P$1 JP10.1 JP11.1 JP12.1 JP13.1 JP14.1 JP15.1 JP16.1 JP17.1 JP18.1 JP19.1 JP20.1 JP21.1 Q4.1S(S) Q4.2S(S) Q4.3S(S) R7.1 R19.1 R20.1 R26.1 R27.1 R28.1 R29.1 R34.1 R35.1 R45.P$1 R45.P$2 R45.P$3 R45.P$4 R46.P$1 R46.P$2 R46.P$3 R46.P$4 R47.P$1 R47.P$2 R47.P$3 R47.P$4 R48.P$1 R48.P$2 R48.P$3 R48.P$4 R49.1 R50.P$1 R50.P$2 R50.P$3 R50.P$4 R51.P$1 R51.P$2 R51.P$3 R51.P$4 R52.1 R53.1 R54.1 R55.1 R74.1 R109.1 R110.1 SW1.B'(S1) SW1.B(S) T1.P$4 U1.P$7(GND) U1.P$13(PGND) U2.P$4(GND) U3.P$11(GND) U4.GND_2(GND) U5.2(GND) U6.2(GND) U8.2/HEAT(GND) U9.10(GND) U10.10(GND) U11.10(GND) U12.2(DGND) U12.3(DGND) U12.4(DGND) U12.18(DGND) U12.31(DGND) U13.P$42(DVSS) U14.12(DGND) U15.4(GND) U16.P$5(GND) U19.1(CLKIN) U19.9(AD0) U19.11(RESV-G) U19.18(GND)
GNDA: C61.P$2 C62.P$2 C91.2 C92.2 C113.2 C114.2 C115.2 C120.2 C121.2 C125.2 C126.2 C130.2 C131.2 C133.2 C134.2 C136.2 C141.2 C142.2 C143.2 C144.2 C145.2 C146.2 C147.2 D7.2(C) D8.2(C) D10.2(C) D11.2(C) D12.2(C) D13.2(C) JP27.SLEEVE JP28.SLEEVE JP30.SLEEVE R78.1 R79.1 R80.1 R81.1 R82.1 R83.1 R84.1 R85.1 R86.1 R90.1 R91.1 R107.1 R108.1 R122.1 R123.1 R124.1 R125.1 SW2.1(LED-) SW2.C SW3.1(LED-) SW3.C U7.2/HEAT(GND) U12.39(AGND) U12.43(AGND) U12.48(AGND) U13.P$15(AVSS_ADC) U13.P$20(DRVSS) U13.P$21(DRVSS) U13.P$26(AVSS_DAC) U13.PAD(DRVSS) U14.3(AGND) U17.2(GND) U18.2(V-)
GNDIO: C1.2 C6.2 C8.2 C36.1 R13.1 R18.2
HPLCOM: C94.2 R86.2
HPLOUT: C89.P$2 R89.1
HPRCOM: C95.2 R85.2
HPROUT: C90.P$2 R88.1
LINE2LM: C104.2 C133.1 D10.1(A) R83.2 R98.1 R107.2
LINE2LP: C102.2 C134.1 D11.1(A) R95.1 R102.1 R108.2
LOUT_N: C88.2 JP24.1
LOUT_P: C87.2 C103.1 JP24.2 R79.2
MIC_AMP: C106.1 C132.1 R81.2 R106.1 U18.1(OUT)
MIC_H: C107.2 C135.2 C143.1 L3.2 MIC1.1 R113.1 R116.1 R117.1
MIC_L: C101.2 C108.2 C144.1 L4.2 MIC1.2 R124.2
MIC_N: C145.1 L4.1
MIC_P: C100.2 C146.1 L3.1
MIC_REG: C131.1 R94.1 R117.2 U17.5(OUT)
MICBIAS: C124.1 R87.2 R95.2 R113.2 U13.P$13(MICBIAS)
MIDI_IN: R104.2 U4.B4
MONO_LOM: C97.2 C99.2 JP25.1 R84.2
MONO_LOP: C96.2 C98.2 C105.1 JP25.2
N$1: R76.P$1 U14.1(CS)
N$2: R76.P$2 U14.16(SCLK)
N$3: R76.P$4 U14.14(DIN)
N$4: R76.P$3 U14.15(DOUT)
N$5: JP26.P$1 U12.11(USB_DN)
N$6: R64.P$5 U13.P$48(MOSI)
N$7: C3.2 L1.P$1 Q3.1S(S) Q3.2S(S) Q3.3S(S) Q4.PAD2(D) Q4.PAD(D) U1.P$6(SW)
N$8: R101.1 SW2.4(SWITCH)
N$9: R105.1 SW2.2(LED1+)
N$10: R111.1 SW2.3(LED2+)
N$11: R121.1 SW3.3(LED2+)
N$12: R119.1 SW3.2(LED1+)
N$13: R30.1 R34.2 U5.4(FB)
N$14: JP26.P$2 U12.12(USB_DP)
N$15: R62.P$4 U12.32(SPI_CS)
N$16: R62.P$3 U12.33(SPI_CLK)
N$17: R62.P$2 U12.34(SPI_MISO)
N$18: R62.P$1 U12.35(SPI_MOSI)
N$19: R32.2 U5.3(EN)
N$21: Q3.4G(G) U1.P$5(TG)
N$22: C3.1 D3.P$1(C) U1.P$4(BOOST)
N$23: C6.1 U1.P$3(RUN/SS)
N$24: C7.2 R13.2
N$25: C36.2 R18.1 R21.2 U1.P$1(FB)
N$26: C7.1 C8.1 U1.P$2(ITH)
N$27: Q4.4G(G) U1.P$8(BG)
N$28: C9.1 D3.P$2(A) U1.P$9(INTVCC)
N$29: C147.1 R118.1 R125.2 U18.3(+IN)
N$30: C135.1 R112.2
N$31: C56.P$1 FB5.2 U4.VIN
N$32: C132.2 R106.2 R112.1 U18.4(-IN)
N$33: C37.1 R16.2 U1.P$12(SENSE+)
N$34: C40.1 U2.P$3(TMR)
N$35: C2.P$1 J1.PWR JP1.P$1 T1.P$1
N$36: C37.2 R17.2 U1.P$11(SENSE-)
N$37: C2.P$2 J1.GND J1.GNDBREAK JP2.P$1 T1.P$2
N$38: C4.P$1 D2.P$1(A) FB1.1 T1.P$3
N$39: L1.P$2 R2.2 R11.2 R16.1
N$40: C1.1 R1.2 U1.P$10(VIN)
N$41: C39.1 R6.1 R8.1 U2.P$6(VIN)
N$42: JP8.P$1 R32.1
N$43: Q2.1(G) R10.2
N$44: R9.1 R10.1 R12.1 U2.P$7(EN)
N$45: D1.A Q1.1(G) R7.2
N$46: C41.1 JP4.P$1 R3.1 R14.1 R20.2 U2.P$2(KILL)
N$47: R5.1 R19.2 U2.P$1(ON)
N$49: C43.1 C45.P$1 D5.1(A) FB2.1 L2.P$2 R23.2 U3.P$1(BD)
N$50: JP9.P$1 R33.1
N$55: FB7.1 FB8.1 U4.W2_5V_4(A_B_POWER:5V0)
N$56: FB6.2 U4.W2_2V5_3(A_B_POWER:2V5)
N$57: FB9.1 U4.W2_3V3_4(A_B_POWER:3V3)
N$144: C91.1 C92.1 FB11.1 U14.2(VA)
N$155: C140.1 U19.20(CPOUT)
N$156: C139.1 U19.10(REGOUT)
N$157: C138.1 U19.8(VLOGIC)
N$196: C96.1 U12.44(AUDIO_IN_P_LEFT)
N$197: C97.1 U12.45(AUDIO_IN_N_LEFT)
N$205: R69.P$6 U12.15(RXD)
N$206: R69.P$5 U12.16(TXD)
N$216: R63.1 U12.36(LED0)
N$217: R69.P$8 U12.13(PIO9)
N$218: R69.P$7 U12.14(PIO10)
N$222: C38.1 JP5.1 R4.1 R15.2 SW1.A'(P1) SW1.A(P) U2.P$5(PB)
N$232: D1.C Q1.3(S) Q2.3(S) R8.2 R9.2
N$237: R58.1 U12.1(VREG_ENA)
N$239: D6.2(C) R63.2
N$240: R75.1 U12.47(AUDIO_OUT_P_RIGHT)
N$241: R73.1 U12.46(AUDIO_OUT_N_RIGHT)
N$242: R71.1 U12.50(AUDIO_OUT_P_LEFT)
N$243: R70.1 U12.49(AUDIO_OUT_N_LEFT)
N$247: JP22.P$3 R56.1 U12.19(RESET)
N$251: C42.2 D4.P$1(C) L2.P$1 U3.P$3(SW)
N$252: C42.1 U3.P$2(BOOST)
N$253: R25.1 U3.P$9(PG)
N$254: C43.2 R23.1 R29.2 U3.P$6(FB)
N$255: R26.2 U3.P$10(SYNC)
N$256: R28.2 U3.P$8(RT)
N$257: R24.2 U3.P$7(SS)
N$258: C55.1 R24.1
N$259: R22.1 R27.2 U3.P$5(EN)
N$262: D5.2(C) R25.2
N$263: JP29.5(MIDI_OUT) R96.1
N$264: D9.P$1(C) R93.1 R96.2 R110.2 U16.P$2(A)
N$265: D9.P$2(A) JP29.4(MIDI_IN) R92.1 R109.2 U16.P$3(C)
N$266: R100.1 R104.1 U16.P$6(VO)
N$270: R77.P$8 U12.27(PCM_IN)
N$271: R77.P$7 U12.28(PCM_OUT)
N$272: R77.P$6 U12.29(PCM_SYNC)
N$274: R77.P$5 U12.30(PCM_CLK)
N$275: R41.P$1 U10.14(Y5)
N$276: R37.P$1 U10.18(Y1)
N$277: R37.P$2 U10.17(Y2)
N$278: R37.P$3 U10.16(Y3)
N$279: R37.P$4 U10.15(Y4)
N$280: R41.P$2 U10.13(Y6)
N$281: R41.P$3 U10.12(Y7)
N$282: R41.P$4 U10.11(Y8)
N$289: R39.P$1 U9.14(Y5)
N$290: R36.P$1 U9.18(Y1)
N$291: R36.P$2 U9.17(Y2)
N$292: R36.P$3 U9.16(Y3)
N$293: R36.P$4 U9.15(Y4)
N$294: R39.P$2 U9.13(Y6)
N$295: R39.P$3 U9.12(Y7)
N$296: R39.P$4 U9.11(Y8)
N$303: C100.1 U12.41(AUDIO_IN_P_RIGHT)
N$304: C101.1 U12.42(AUDIO_IN_N_RIGHT)
N$307: R97.1 R103.1 U17.3(EN)
N$313: C85.1 U13.P$31(RIGHT_LOP)
N$314: C86.1 U13.P$32(RIGHT_LOM)
N$315: C87.1 U13.P$29(LEFT_LOP)
N$316: C88.1 U13.P$30(LEFT_LOM)
N$317: C89.P$1 U13.P$18(HPLOUT)
N$318: C90.P$1 U13.P$23(HPROUT)
N$319: C123.1 U13.P$14(MIC3R/LINE3R)
N$320: C122.1 U13.P$11(MIC3L/LINE3L)
N$321: C109.1 U13.P$7(MIC2LP/LINE2LP)
N$322: C110.1 U13.P$8(MIC2LM/LINE2LM)
N$323: C111.1 U13.P$9(MIC2RP/LINE2RP)
N$324: C112.1 U13.P$10(MIC2RM/LINE2RM)
N$325: C94.1 U13.P$19(HPLCOM)
N$326: C95.1 U13.P$22(HPRCOM)
N$327: C98.1 U13.P$27(MONO_LOP)
N$328: C99.1 U13.P$28(MONO_LOM)
N$329: C102.1 U13.P$3(MIC1LP/LINE1LP)
N$330: R43.P$1 U11.14(Y5)
N$331: R38.P$1 U11.18(Y1)
N$333: C104.1 U13.P$4(MIC1LM/LINE1LM)
N$334: R38.P$2 U11.17(Y2)
N$335: R38.P$3 U11.16(Y3)
N$336: C107.1 U13.P$5(MIC1RP/LINE1RP)
N$342: R38.P$4 U11.15(Y4)
N$343: R43.P$2 U11.13(Y6)
N$344: R43.P$3 U11.12(Y7)
N$345: R43.P$4 U11.11(Y8)
N$363: C108.1 U13.P$6(MIC1RM/LINE1RM)
N$364: R87.1 U13.P$12(MICDET)
N$371: R72.2 R74.2 U13.P$43(SELECT)
N$378: R64.P$6 U13.P$47(MISO)
N$379: R64.P$7 U13.P$46(SCLK/ADR1)
N$380: R64.P$8 U13.P$45(CSEL/ADR0)
N$384: R57.2 R59.2 U13.P$33(_RESET)
N$385: C125.1 D7.1(A) JP27.RING R88.2 R90.2
N$386: C126.1 D8.1(A) JP27.TIP R89.2 R91.2
N$387: JP30.RING R114.2
N$388: JP30.TIP R120.2
N$389: JP28.RING R98.2
N$390: JP28.TIP R102.2
N$391: R31.1 R35.2 U6.4(FB)
N$392: R33.2 U6.3(EN)
ROUT_N: C86.2 JP23.1
ROUT_P: C85.2 JP23.2
SCL: R61.2 U4.C14 U13.P$1(SCL) U19.23(SCL)
SDA: R60.2 U4.C15 U13.P$2(SDA) U19.24(SDA)
SHUTDOWN: JP3.P$1 R12.2
V+: C52.P$1 C53.P$1 C54.P$1 C63.1 C64.1 C65.1 C66.1 C67.P$2(+) C68.1 C69.1 C70.P$2(+) C71.P$1 C72.P$1 C73.P$1 C74.P$1 C75.P$1 C76.P$1 C77.P$1 C78.P$1 C79.P$1 C80.P$1 C81.P$1 C82.P$1 FB3.1 FB4.1 FB8.2 JP6.P$1 JP10.4 JP11.4 JP12.4 JP13.4 JP14.4 JP15.4 JP16.4 JP17.4 JP18.4 JP19.4 JP20.4 JP21.4 R40.2 R42.2 R44.2 U9.20(VCC) U10.20(VCC) U11.20(VCC)
VCCIO: C62.P$1 C136.1 FB10.2 FB11.2 FB12.1 R65.2 R66.2 R67.2 R99.P$5 R99.P$6 R99.P$7 R99.P$8 R105.2 R111.2 R115.2 R116.2 R118.2 R119.2 R121.2 U7.3(OUT) U18.5(V+)
VIN: C27.P$1 C28.P$1 C29.P$1 C30.P$1 C31.P$1 C32.P$1 C33.P$1 C34.P$1 C35.P$2(+) C44.P$1 Q2.2/HEAT(D) Q3.PAD2(D) Q3.PAD(D) R1.1 R3.2 R4.2 R22.2 U3.P$4(VIN)
VIN-RAW: C5.P$1 FB1.2 Q1.2/HEAT(D) R5.2 R6.2
Unconnected: JP27.RSH JP27.TSH JP28.RSH JP28.TSH JP29.1(NC1) JP29.2(NC2) JP29.3(NC3) JP30.RSH JP30.TSH U2.P$8(INT) U4.GND U4.REF U4.TCK U4.TDI U4.TDO U4.TMS U4.W2_2V5(A_B_POWER:2V5) U4.W2_2V5_2(A_B_POWER:2V5) U4.W2_2V5_4(A_B_POWER:2V5) U4.W2_3V3(A_B_POWER:3V3) U4.W2_3V3_2(A_B_POWER:3V3) U4.W2_3V3_3(A_B_POWER:3V3) U4.W2_5V(A_B_POWER:5V0) U4.W2_5V_2(A_B_POWER:5V0) U4.W2_5V_3(A_B_POWER:5V0) U4.W3_2V5(C_POWER:2V5) U4.W3_2V5_2(C_POWER:2V5) U4.W3_3V3(C_POWER:3V3) U4.W3_3V3_2(C_POWER:3V3) U4.W3_5V(C_POWER:5V0) U4.W3_5V_2(C_POWER:5V0) U12.5(AIO0) U12.6(AIO1) U12.7(PIO0) U12.8(PIO1) U12.9(PIO2) U12.10(PIO3) U12.22(PIO8) U12.23(PIO7) U12.24(PIO6) U12.25(PIO5) U12.26(PIO4) U12.38(VDD_CHG) U16.P$7(VB) U17.4(FB) U19.12(INT)

## Notes on the sheet
- Power Input | Power Regulation
- FIX THESE VALUES
- Papilio Connections
- SPI Buffer Transcievers
- Bluetooth | Audio Codec | SPI ADC
- *This reset line needs to be actively controlled
- Place R164 to enable BT secondary PCM input
- Unbalanced Stereo Out
- MIDI Input | MISC IO
- Balanced Mono in
- Unbalanced Stereo In

## Power pins joined to a net without a drawn wire
GND: U4.W2_GND(A_B_POWER:GND) U4.W2_GND_2(A_B_POWER:GND) U4.W2_GND_3(A_B_POWER:GND) U4.W2_GND_4(A_B_POWER:GND) U4.W3_GND(C_POWER:GND) U4.W3_GND_2(C_POWER:GND)

## Library data of the parts
C1-C23 C27-C34 C36-C50 C52-C66 C68 C69 C71-C147 = 1_Dan Master:CAPACITOR: SMT Capacitor
C24-C26 C35 C51 C67 C70 = 1_Dan Master:CAPACITOR_ELEC: Electrolytic Capacitor, SMT
D1 = 1_Dan Master:ZENER_: Zener diode
D2 D7 D8 D10-D13 = 1_Dan Master:SURGESUPPRESSOR
D3 D4 D9 = 1_Dan Master:DIODE_SMD: Diode
D5 D6 = 1_Dan Master:LED: Chip Mount, SMT, LED
FB1-FB13 = 1_Dan Master:FERRITE-BEAD
J1 = SparkFun-Connectors:POWER_JACK: Power Jack This is the standard 5.5mm barrel jack for power. The PTH is the most common, proven, reliable, footprint. All others are experimental. The Slot footprint only works if the mill layer is transmitted to the PCB fab house so be warned. Spark Fun Electronics SKU : PRT-00119. Mating wall wart : TOL-00298 (and others)
JP1 JP2 JP6 JP7 = 1_Dan Master:ANDERSON_POWERPOLE
JP3 JP4 JP8 JP9 = 1_Dan Master:HEADER-SMALL-1PIN
JP5 = SparkFun:M02: Header 2 Standard 2-pin 0.1" header. Use with straight break away headers (SKU : PRT-00116), right angle break away headers (PRT-00553), swiss pins (PRT-00743), machine pins (PRT-00117), and female headers (PRT-00115). Molex polarized connector foot print use with SKU : PRT-08233 with associated crimp pins and housings.
JP10-JP21 = SparkFun-Connectors:M04: Header 4 Standard 4-pin 0.1" header. Use with straight break away headers (SKU : PRT-00116), right angle break away headers (PRT-00553), swiss pins (PRT-00743), machine pins (PRT-00117), and female headers (PRT-00115). Molex polarized connector foot print use with SKU : PRT-08231 with associated crimp pins and housings. 1MM SMD Version SKU: PRT-10208
JP22 = 1_Dan Master:HEADER-SMALL-4PIN
JP23-JP25 = SparkFun-Connectors:M02: Header 2 Standard 2-pin 0.1" header. Use with straight break away headers (SKU : PRT-00116), right angle break away headers (PRT-00553), swiss pins (PRT-00743), machine pins (PRT-00117), and female headers (PRT-00115). Molex polarized connector foot print use with SKU : PRT-08233 with associated crimp pins and housings.
JP26 = 1_Dan Master:HEADER-SMALL-2PIN
JP27 JP28 JP30 = SparkFun-Connectors:AUDIO-JACK2: Stereo audio jack with bypass switches.
JP29 = GadgetFactory:MIDI_CONN_FEMALE_SUPPORT
L1-L4 = 1_Dan Master:INDUCTOR: SMT Inductor
LOGO = 1_Dan Master:LOGO: BES Square Logo
MIC1 = SparkFun-Sensors:MIC: Omni-directional electret microphone. 9.7mm standard diameter.
Q1 Q2 = 1_Dan Master:MOSFET-P_CHANNEL: P-Channel MOSFET SMD, Vishay
Q3 Q4 = 1_Dan Master:MOSFET_N_CHANNEL: N-Channel MOSFET
R1-R35 R40 R42 R44 R49 R52-R61 R63 R65-R67 R70-R75 R78-R98 R100-R125 = 1_Dan Master:RESISTOR: Resistor, Chip Mount, SMT
R36-R39 R41 R43 R45-R48 R50 R51 R62 R64 R68 R69 R76 R77 R99 = 1_Dan Master:RESISTOR_ARRAY_4CH: Resistor Array 4 channel ACASA - 50k @0.5% (http://www.vishay.com/docs/28770/acasat.pdf) ACASA - 10k @0.5% (http://www.vishay.com/docs/28754/acaprof.pdf)
SW1 = adafruit:SPST_TACT: SMT 6mm switch, EVQQ2 series http://www.ladyada.net/library/eagle
SW2 SW3 = 1_Dan Master:ROTARY_ENCODER_SW_2CH_LED
T1 = 1_Dan Master:COMMON_MODE_CHOKE
U1 = 1_Dan Master:LTC3854
U2 = 1_Dan Master:LTC2955
U3 = 1_Dan Master:LT3971: High voltage buck-regulator
U4 = 1_Dan Master:PAPILIO_PLUS_MEGAWING
U5 U6 U17 = 1_Dan Master:LDO_EN_FB
U7 U8 = 1_Dan Master:LDO: LDO 5V, 3.3
U9-U11 = 1_Dan Master:SN74HCT541
U12 = 1_Dan Master:WT32
U13 = 1_Dan Master:TLV320AIC3106: TI Audio Codec
U14 = 1_Dan Master:ADC128S102
U15 = GadgetFactory:FLASH-SPI-25XX: SPI Flash
U16 = 1_Dan Master:6N138: MOTOROLA OPTO COUPLER
U18 = SparkFun:OPA344
U19 = SparkFun:ITG-3200: ITG-3200 3-axis gyro, digital output, qfn24 package

## Net classes
1 Power: width 0.813 mm, drill 0.381 mm, clearance 0.178 mm